# Altium schematic sheet 5-Radio.SchDoc
size A4
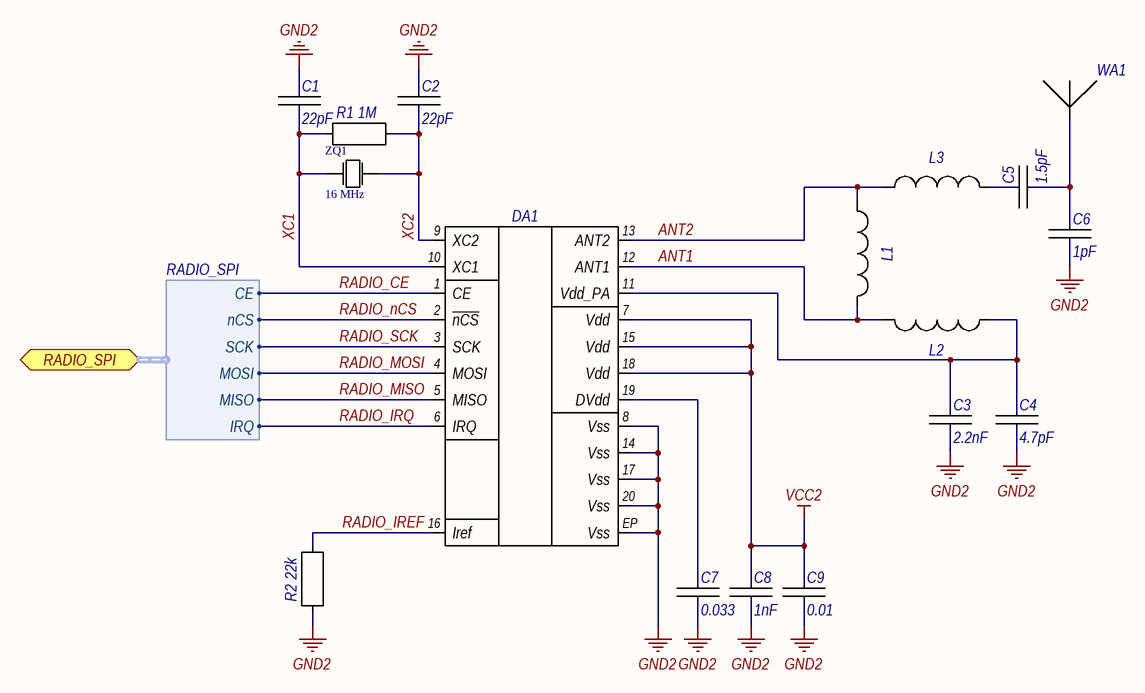
[diagram p0: 5-Radio.SchDoc]

## Parts
C1  value 22pF  [CHIP_0402_C]  (hidden comment: Конденсатор)
C2  value 22pF  [CHIP_0402_C]  (hidden comment: Конденсатор)
C3  value 2.2nF  [CHIP_0402_C]  (hidden comment: Конденсатор)
C4  value 4.7pF  [CHIP_0402_C]  (hidden comment: Конденсатор)
C5  value 1.5pF  [CHIP_0402_C]  (hidden comment: Конденсатор)
C6  value 1pF  [CHIP_0402_C]  (hidden comment: Конденсатор)
C7  value 0.033  [CHIP_0402_C]  (hidden comment: Конденсатор)
C8  value 1nF  [CHIP_0402_C]  (hidden comment: Конденсатор)
C9  value 0.01  [CHIP_0402_C]  (hidden comment: Конденсатор)
DA1  nRF24L01+  [QFN-20 - DIY]  (value not drawn)
L1  Дроссель  [CHIP_0402_L]  (value not drawn)
L2  Дроссель  [CHIP_0402_L]  (value not drawn)
L3  Дроссель  [CHIP_0402_L]  (value not drawn)
R1  value 1M  [CHIP_0402_R]  (hidden comment: Резистор)
R2  value 22k  [CHIP_0402_R]  (hidden comment: Резистор)
WA1  Antenna  [ANTENNA PCB 2.4]  (value not drawn)  (net tie, no BOM)
ZQ1  16 MHz  [HC-49SM]

## Ports
RADIO_SPI (harness RADIO_SPI)

## Harnesses
RADIO_SPI: CE, nCS, SCK, MOSI, MISO, IRQ

## Nets
GND2: C1.2 C2.2 C3.1 C4.1 C6.1 C7.1 C8.1 C9.1 DA1.8(Vss) DA1.14(Vss) DA1.17(Vss) DA1.20(Vss) DA1.EP(Vss) R2.1
VCC2: C8.2 C9.2 DA1.7(Vdd) DA1.15(Vdd) DA1.18(Vdd)
ANT1: DA1.12(ANT1) L1.1 L2.2
ANT2: DA1.13(ANT2) L1.2 L3.2
RADIO_CE: DA1.1(CE) ; port RADIO_SPI.CE
RADIO_IREF: DA1.16(Iref) R2.2
RADIO_IRQ: DA1.6(IRQ) ; port RADIO_SPI.IRQ
RADIO_MISO: DA1.5(MISO) ; port RADIO_SPI.MISO
RADIO_MOSI: DA1.4(MOSI) ; port RADIO_SPI.MOSI
RADIO_nCS: DA1.2(~{nCS}) ; port RADIO_SPI.nCS
RADIO_SCK: DA1.3(SCK) ; port RADIO_SPI.SCK
XC1: C1.1 DA1.10(XC1) R1.1 ZQ1.1
XC2: C2.1 DA1.9(XC2) R1.2 ZQ1.2
NetC3_2: C3.2 C4.2 DA1.11(Vdd_PA) L2.1
NetC5_1: C5.1 C6.2 WA1.1
NetC5_2: C5.2 L3.1
NetC7_2: C7.2 DA1.19(DVdd)

## Library data of the parts
C1 C2 = Конденсатор: PartNumber: CC0402JRNPO9BN220; Mfg: YAGEO
C3 = Конденсатор: PartNumber: GRM155R71H222KA01D; Mfg: MURATA
C4 = Конденсатор: PartNumber: CC0402BRNPO9BN4R7; Mfg: YAGEO
C5 = Конденсатор: PartNumber: CC0402CRNPO9BN1R5; Mfg: YAGEO
C6 = Конденсатор: PartNumber: CC0402BRNPO9BNR50; Mfg: YAGEO
C7 = Конденсатор: PartNumber: CC0402KRX7R7BB333; Mfg: YAGEO
C8 = Конденсатор: PartNumber: CC0402JRNPO9BN102; Mfg: YAGEO
C9 = Конденсатор: PartNumber: CC0402KRX7R9BB103; Mfg: YAGEO
DA1 = nRF24L01+: RF, 2.4 GHz Transceiver; Mfg: NORDIC SEMI; PartNumber: nRF24L01+
L1 = Дроссель: PartNumber: LQW15AN8N2G00D; Mfg: MURATA; Value: 8.2nH
L2 = Дроссель: PartNumber: LQG15HS27NJ02D; Mfg: MURATA; Value: 2.7nH
L3 = Дроссель: PartNumber: LQG15HN3N9S02D; Mfg: MURATA; Value: 3.9nH
R1 = Резистор: PartNumber: RC0402FR-071ML; Mfg: YAGEO
R2 = Резистор: PartNumber: RC0402FR-0722KL; Mfg: YAGEO
ZQ1 = XTAL_2pin: Осциллятор, 2 вывода; PartNumber: 16000 KHz HC-49/US; Type: MG3A; Value: 16 MHz